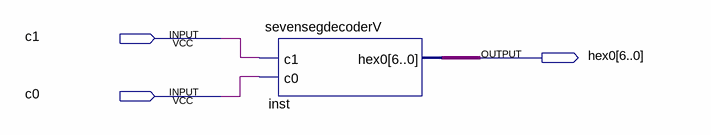
[diagram p0: schematic sheet]
// Quartus schematic sevensegdecoder.bdf as structural Verilog: 1 symbols, 3 pins
module sevensegdecoder (
  input  c1,
  input  c0,
  output [6:0] hex0
);

  sevensegdecoderV inst (.c1(c1), .c0(c0), .hex0(hex0));
endmodule
